# EAGLE design Adattatore Display (EAGLE 4.14)
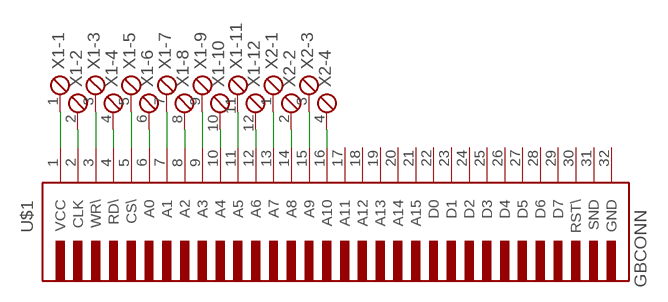
[diagram p0: schematic, sheet 1]

## Parts
U$1  GBCONN  [GBCONN]
X1  MPT12  [12POL254]
X2  MPT4  [4POL254]

## Nets
N$1: U$1.1(VCC) X1.1
N$2: U$1.2(CLK) X1.2
N$3: U$1.3(WR\) X1.3
N$4: U$1.4(RD\) X1.4
N$5: U$1.5(CS\) X1.5
N$6: U$1.6(A0) X1.6
N$7: U$1.7(A1) X1.7
N$8: U$1.8(A2) X1.8
N$9: U$1.9(A3) X1.9
N$10: U$1.10(A4) X1.10
N$11: U$1.11(A5) X1.11
N$12: U$1.12(A6) X1.12
N$13: U$1.13(A7) X2.1
N$14: U$1.14(A8) X2.2
N$15: U$1.15(A9) X2.3
N$16: U$1.16(A10) X2.4
Unconnected: U$1.17(A11) U$1.18(A12) U$1.19(A13) U$1.20(A14) U$1.21(A15) U$1.22(D0) U$1.23(D1) U$1.24(D2) U$1.25(D3) U$1.26(D4) U$1.27(D5) U$1.28(D6) U$1.29(D7) U$1.30(RST\) U$1.31(SND)

## Power pins joined to a net without a drawn wire
GND: U$1.32(GND)

## Library data of the parts
U$1 = gameboy:GBCONN
X1 = con-phoenix-254:MPT12: PHOENIX CONNECTOR
X2 = con-phoenix-254:MPT4: PHOENIX CONNECTOR

## Board
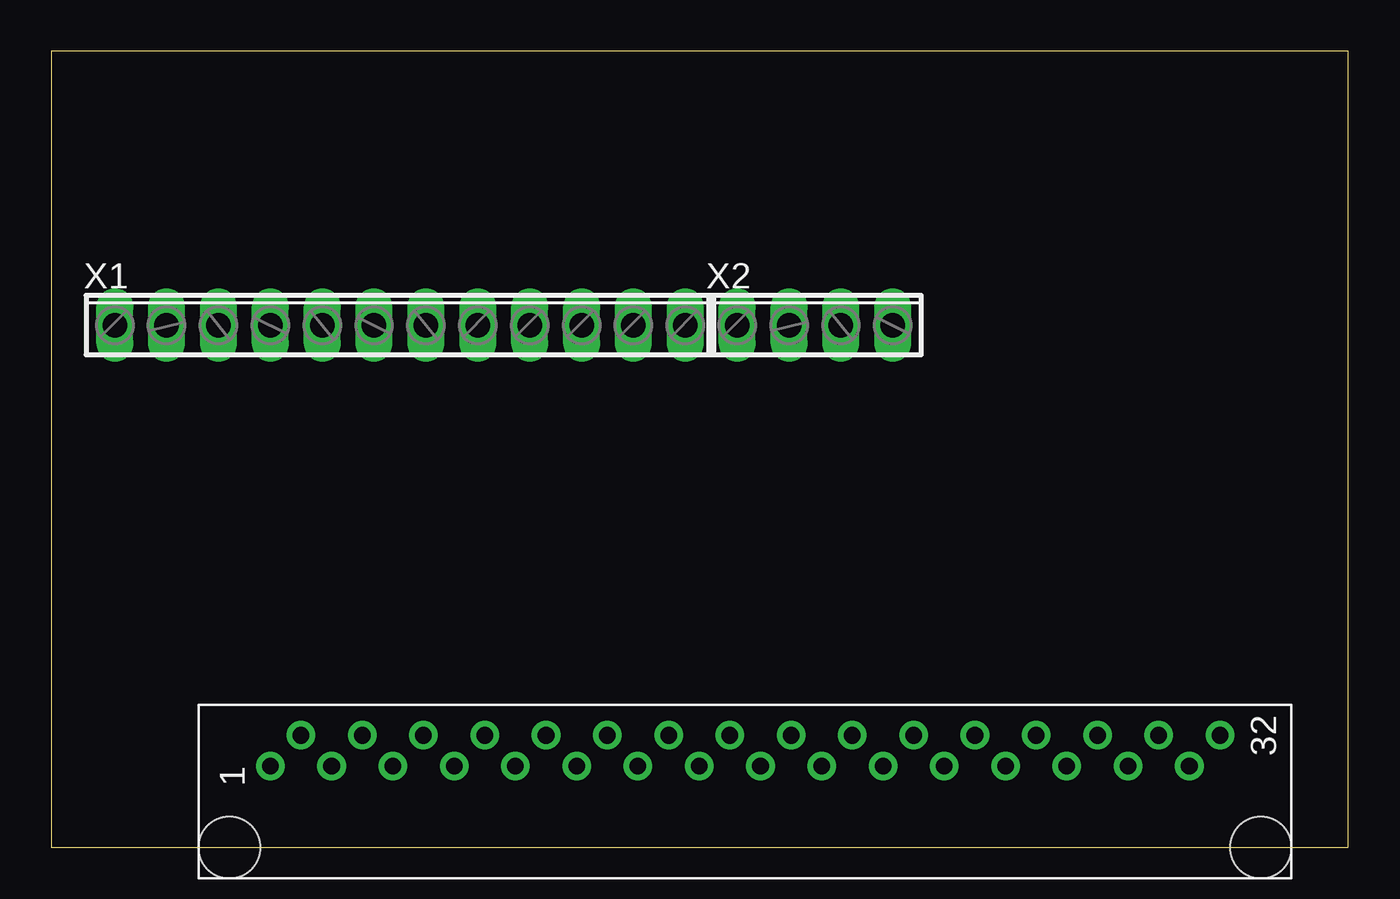
[diagram p1: board, top side]
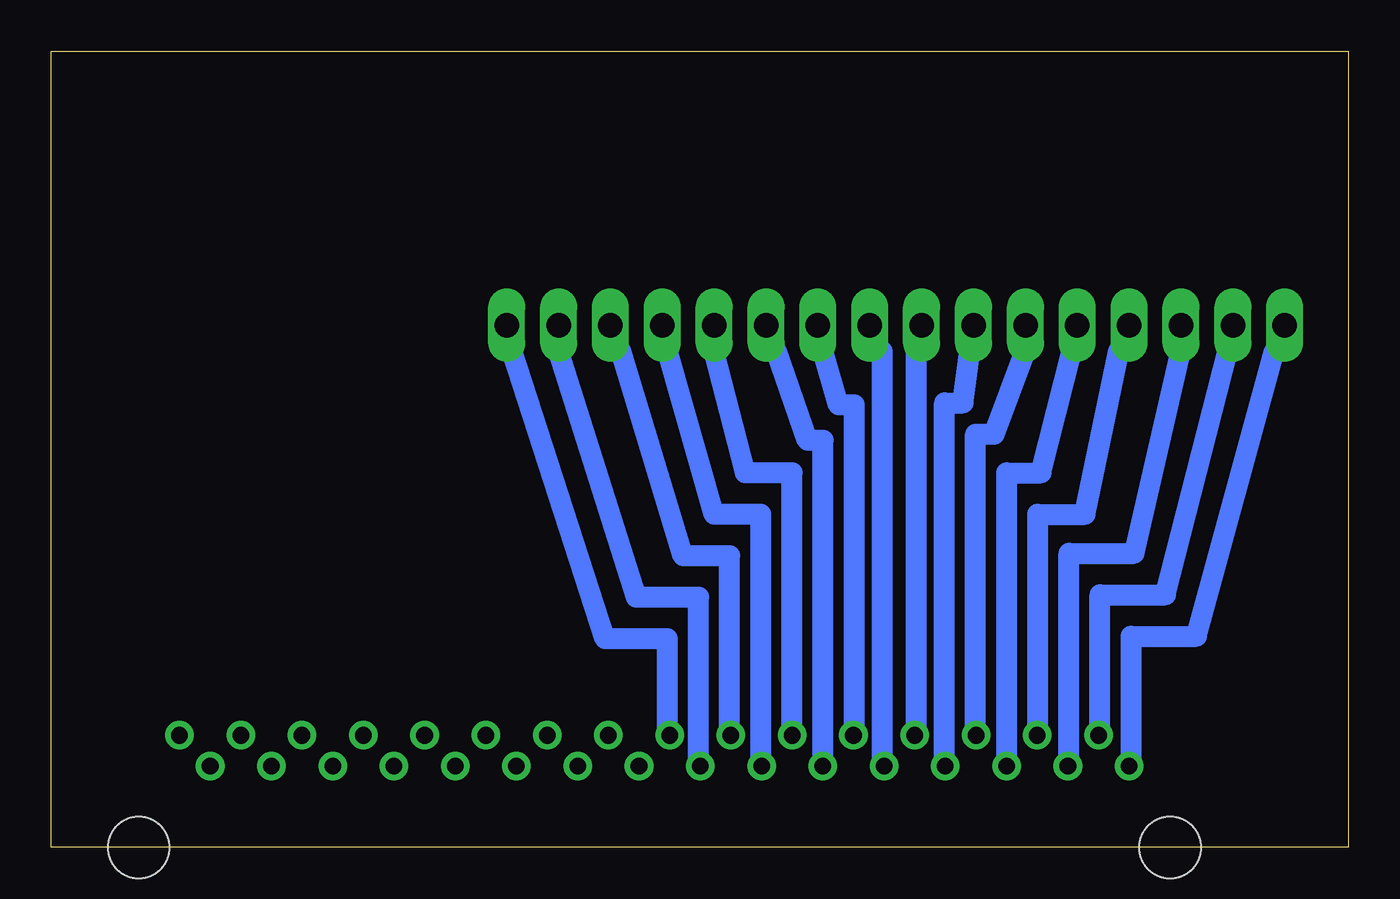
[diagram p2: board, bottom side, seen from below]

Size 63.53 x 38.99 mm. Coordinates in mm from the lower left corner, seen from the top.
Outline: 0,0 63.53,0 63.53,38.99 0,38.99 0,0
Copper layers (1*16): Top 0.035mm / dielectric 1.5mm / Bottom 0.035mm
Design rules "default": minimum track width 10mil, minimum drill 24mil, track to track 8mil, track to pad 8mil, pad to pad 8mil, via to via 8mil, smd to smd 8mil, copper to edge 40mil, drill to drill 8mil, minimum pad ring 10mil, minimum via ring 8mil, stop-mask expansion 4mil, vias tented up to drill 0mil, thermal gap 10mil

### Footprints (pad centres in the part's own frame; a part is rotated, then mirrored left to right if it is on the bottom)
GBCONN = drill 0.813 pad 1.397 round: 1 -22.86,1.27; 2 -21.36,2.77; 3 -19.86,1.27; 4 -18.36,2.77; 5 -16.86,1.27; 6 -15.36,2.77; 7 -13.86,1.27; 8 -12.36,2.77; 9 -10.86,1.27; 10 -9.36,2.77; 11 -7.86,1.27; 12 -6.36,2.77; 13 -4.86,1.27; 14 -3.36,2.77; 15 -1.86,1.27; 16 -0.36,2.77; 17 1.14,1.27; 18 2.64,2.77; 19 4.14,1.27; 20 5.64,2.77; 21 7.14,1.27; 22 8.64,2.77; 23 10.14,1.27; 24 11.64,2.77; 25 13.14,1.27; 26 14.64,2.77; 27 16.14,1.27; 28 17.64,2.77; 29 19.14,1.27; 30 20.64,2.77; 31 22.14,1.27; 32 23.64,2.77 | hole 3: 25.64,-2.73; -24.86,-2.73
12POL254 = drill 1.2 long: 1 -13.97,0; 2 -11.43,0; 3 -8.89,0; 4 -6.35,0; 5 -3.81,0; 6 -1.27,0; 7 1.27,0; 8 3.81,0; 9 6.35,0; 10 8.89,0; 11 11.43,0; 12 13.97,0
4POL254 = drill 1.2 long: 1 -3.81,0; 2 -1.27,0; 3 1.27,0; 4 3.81,0

### Placement (x,y rotation side)
U$1  33.6,2.71 0 top
X1  17.09,25.57 0 top
X2  37.41,25.57 0 top

### Tracks (layer width: path | path; a pad name or v marks a point on that pad's centre or on a via)
N$1
  Bottom 0.254: U$1.1 10.64,4.23 | 3.63,24.3 X1.1
  Bottom 1.016: 10.64,4.23 10.64,10.33 7.44,10.33 3.63,24.3
N$2
  Bottom 0.254: U$1.2 12.16,5.75
  Bottom 0.61: 5.91,24.3 X1.2
  Bottom 1.016: 12.16,5.75 12.16,12.36 8.96,12.36 5.91,24.3
N$3
  Bottom 0.254: U$1.3 13.69,4.23 | 8.2,24.3 X1.3
  Bottom 1.016: 13.69,4.23 13.69,14.39 10.49,14.39 8.2,24.3
N$4
  Bottom 0.254: U$1.4 15.21,5.75 | 11.25,24.3 X1.4
  Bottom 1.016: 15.21,5.75 15.21,16.29 12.9,16.29 11.25,24.3
N$5
  Bottom 0.254: U$1.5 16.73,4.23 | 13.53,24.3 X1.5
  Bottom 1.016: 16.73,4.23 16.73,18.33 15.06,18.33 13.53,24.3
N$6
  Bottom 0.254: U$1.6 18.26,5.75
  Bottom 1.016: 18.26,5.75 18.26,20.23 17.34,20.23 15.82,24.3 X1.6
N$7
  Bottom 0.254: U$1.7 19.78,4.23
  Bottom 1.016: 19.78,4.23 19.78,21.76 18.87,21.76 X1.7
N$8
  Bottom 0.254: U$1.8 21.15,5.75 | 21.15,24.3 X1.8
  Bottom 1.016: 21.15,5.75 21.15,24.3
N$9
  Bottom 0.254: U$1.9 22.83,4.23 | 22.83,24.3 X1.9
  Bottom 1.016: 22.83,4.23 22.83,24.3
N$10
  Bottom 0.254: U$1.10 24.2,5.75 | 25.73,24.3 X1.10
  Bottom 1.016: 24.2,5.75 24.2,21.65 24.96,21.65 25.73,24.3
N$11
  Bottom 0.254: U$1.11 25.73,4.23 | 28.01,24.3 X1.11
  Bottom 1.016: 25.73,4.23 25.73,19.93 26.49,19.93 28.01,24.3
N$12
  Bottom 0.254: U$1.12 27.25,5.75 | 31.06,24.3 X1.12
  Bottom 1.016: 27.25,5.75 27.25,18.33 29.54,18.33 31.06,24.3
N$13
  Bottom 0.254: U$1.13 28.77,4.23 | 33.35,24.3 X2.1
  Bottom 1.016: 28.77,4.23 28.77,16.29 31.06,16.29 33.35,24.3
N$14
  Bottom 0.254: U$1.14 30.3,5.75 | 35.63,24.3 X2.2
  Bottom 1.016: 30.3,5.75 30.3,14.26 32.58,14.26 35.63,24.3
N$15
  Bottom 0.254: U$1.15 31.82,4.23 | 38.68,24.3 X2.3
  Bottom 1.016: 31.82,4.23 31.82,12.23 34.87,12.23 38.68,24.3
N$16
  Bottom 0.254: U$1.16 33.35,5.75 | 40.97,24.3 X2.4
  Bottom 1.016: 33.35,5.75 33.35,10.2 36.39,10.2 40.97,24.3